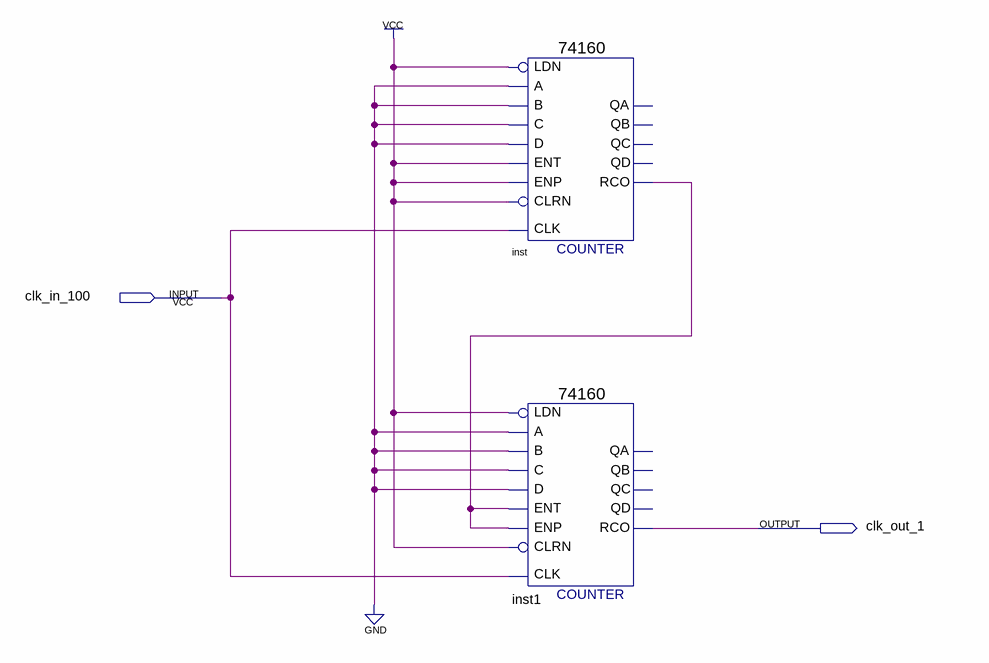
[diagram p0: schematic sheet]
// Quartus schematic cnt100.bdf as structural Verilog: 2 symbols, 2 pins
module cnt100 (
  input  clk_in_100,
  output clk_out_1
);

  wire inst_rco;

  \74160  inst (
    .CLK(clk_in_100), .ENT(1'b1), .A(1'b0), .B(1'b0), .C(1'b0), .D(1'b0), .LDN(1'b1), .ENP(1'b1),
    .CLRN(1'b1), .RCO(inst_rco));  // open: QD, QA, QB, QC
  \74160  inst1 (
    .CLK(clk_in_100), .ENT(inst_rco), .A(1'b0), .B(1'b0), .C(1'b0), .D(1'b0), .LDN(1'b1), .ENP(inst_rco),
    .CLRN(1'b1), .RCO(clk_out_1));  // open: QD, QA, QB, QC
endmodule
